# EAGLE design RoverPower (EAGLE 6.4)
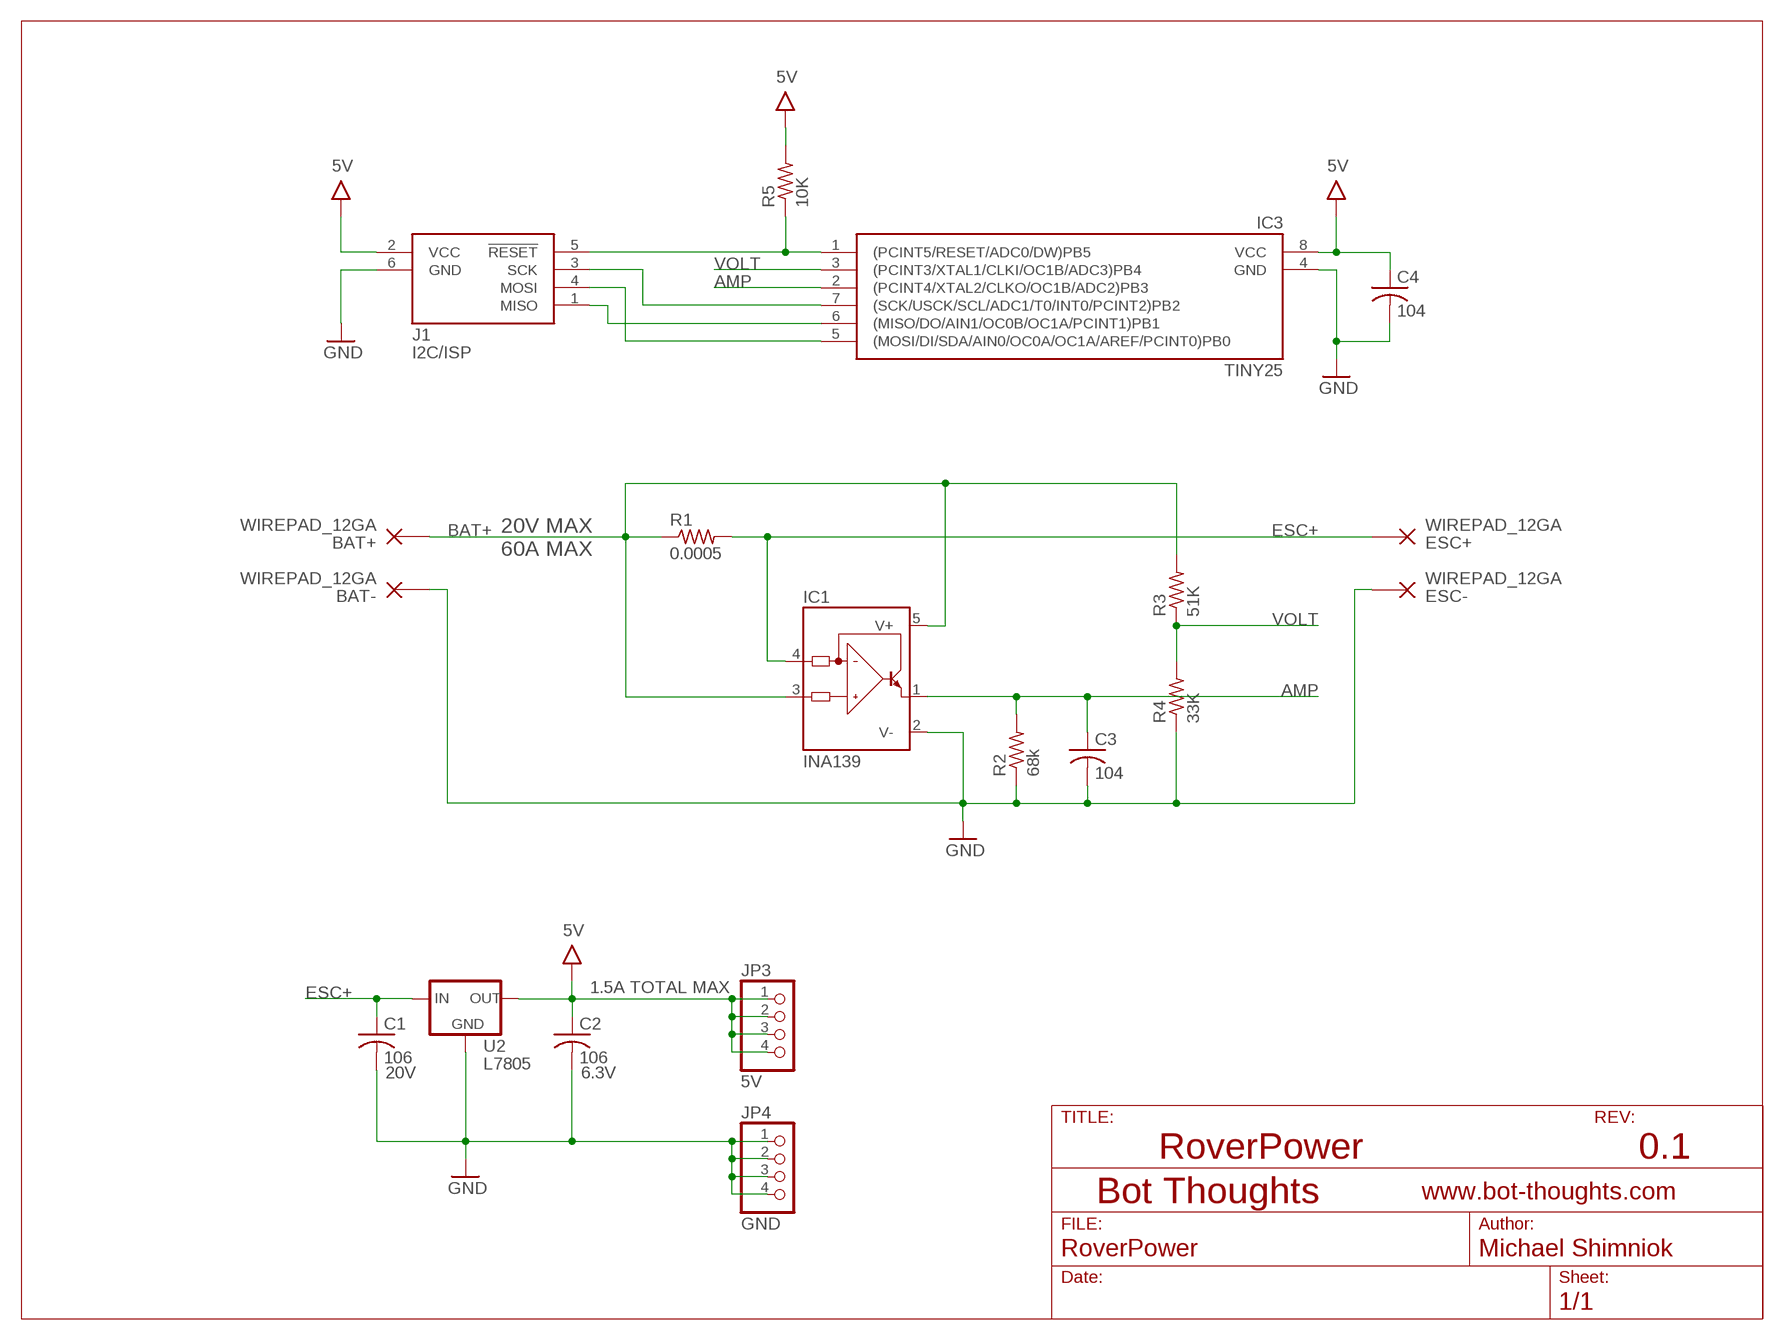
[diagram p0: schematic, sheet 1]

## Parts
BAT+  WIREPAD_12GA  [PAD_12GA]
BAT-  WIREPAD_12GA  [PAD_12GA]
C1  106  C-USC1206  [C1206]
C2  106  C-USC1206  [C1206]
C3  104  C-USC0603  [C0603]
C4  104  C-USC0603  [C0603]
ESC+  WIREPAD_12GA  [PAD_12GA]
ESC-  WIREPAD_12GA  [PAD_12GA]
IC1  INA139  INA168  [SOT23-5]
IC3  TINY25  TINY25/45/85-20SU  [SOIC8]
J1  I2C/ISP  AVRISP6  [CON6P2R]
JP3  5V  PINHD-1X04_2.54-S  [1X04-S]
JP4  GND  PINHD-1X04_2.54-S  [1X04-S]
R1  0.0005  R-US__2512  [R2512]
R2  68k  R-US_R0603  [R0603]
R3  51K  R-US_R0603  [R0603]
R4  33K  R-US_R0603  [R0603]
R5  10K  R-US_R0603  [R0603]
U2  L7805  L78XXD2TT  [D2PAK]

## Nets
5V: C2.1 C4.1 IC3.8(VCC) J1.2(VCC) JP3.1 JP3.2 JP3.3 JP3.4 R5.2 U2.3(OUT)
!RESET: IC3.1((PCINT5/RESET/ADC0/DW)PB5) J1.5(!RESET) R5.1
AMP: C3.1 IC1.1(OUT) IC3.2((PCINT4/XTAL2/CLKO/OC1B/ADC2)PB3) R2.2
BAT+: BAT+.P$1(P) IC1.3(IN+) IC1.5(V+) R1.P$1 R3.2
ESC+: C1.1 ESC+.P$1(P) IC1.4(IN-) R1.P$2 U2.1(IN)
GND: BAT-.P$1(P) C1.2 C2.2 C3.2 C4.2 ESC-.P$1(P) IC1.2(V-) IC3.4(GND) J1.6(GND) JP4.1 JP4.2 JP4.3 JP4.4 R2.1 R4.1 U2.2(GND)
MISO: IC3.6((MISO/DO/AIN1/OC0B/OC1A/PCINT1)PB1) J1.1(MISO)
SCL: IC3.7((SCK/USCK/SCL/ADC1/T0/INT0/PCINT2)PB2) J1.3(SCK)
SDA: IC3.5((MOSI/DI/SDA/AIN0/OC0A/OC1A/AREF/PCINT0)PB0) J1.4(MOSI)
VOLT: IC3.3((PCINT3/XTAL1/CLKI/OC1B/ADC3)PB4) R3.1 R4.2

## Notes on the sheet
- 20V MAX
- 60A MAX
- 1.5A TOTAL MAX
- RoverPower | 0.1

## Library data of the parts
BAT+ BAT- ESC+ ESC- = bt_electromech:WIREPAD: PIN PAD (PINPAD) Generic pin pad connector
C1 = rcl:C-US: CAPACITOR, American symbol; VOLTAGE: 20V
C2 = rcl:C-US: CAPACITOR, American symbol; VOLTAGE: 6.3V
C3 = resistor:C-US: CAPACITOR, American symbol
C4 = rcl:C-US: CAPACITOR, American symbol
IC1 = burr-brown:INA168: High-Side Measurement Current Shunt Monitor; MF: TEXAS INSTRUMENTS; MPN: INA168NA/250; OC_FARNELL: 4375737; OC_NEWARK: 35C1744
IC3 = bt_avr:TINY25/45/85: Atmel AVR ATiny25,45,85 8-bit Microcontroller
J1 = bt_avr:AVRISP6: 6-pin dual-row connector for Atmel AVRISP programmer interface
JP3 JP4 = pinhead-2:PINHD-1X04: PIN HEADER
R1 = bt:R-US_: RESISTOR, American symbol
R2 = rcl:R-US_: RESISTOR, American symbol
R3-R5 = resistor:R-US_: RESISTOR, American symbol
U2 = v-reg-3:L78XX: VOLTAGE REGULATOR

## Board
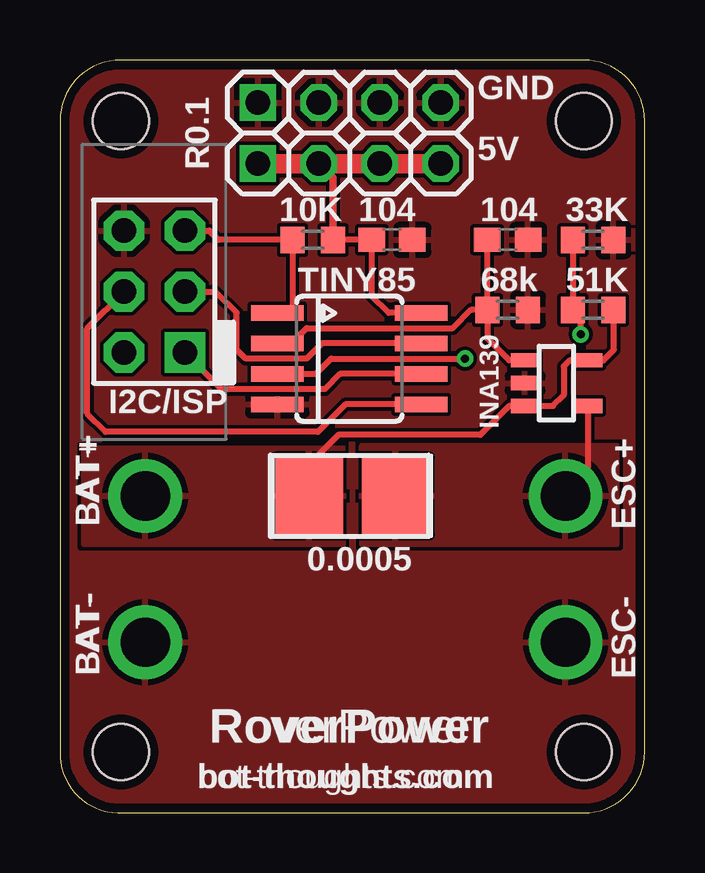
[diagram p1: board, top side]
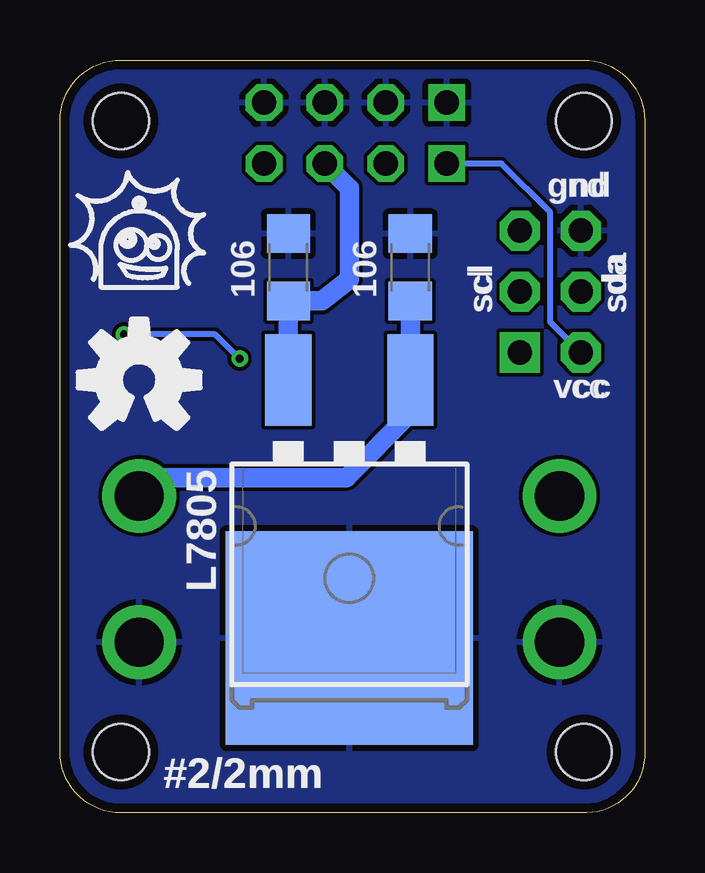
[diagram p2: board, bottom side, seen from below]

Size 24.38 x 31.37 mm. Coordinates in mm from the lower left corner, seen from the top.
Outline: 0,28.83 0,2.54 arc90 2.41,0 21.84,0 arc90 24.38,2.54 24.38,28.83 arc90 21.84,31.37 2.54,31.37 arc90 0,28.83
Copper layers (1*16): Top 0.0356mm / dielectric 1.5011mm / Bottom 0.0356mm
Design rules "LaenPCBOrder": minimum track width 6mil, minimum drill 13mil, track to track 6mil, track to pad 6mil, pad to pad 6mil, via to via 6mil, smd to smd 6mil, copper to edge 15mil, drill to drill 6mil, minimum pad ring 7mil, minimum via ring 7mil, stop-mask expansion 4mil, vias tented up to drill 20mil, thermal gap 10mil
Holes 2.34 mm at 2.54,28.83 21.84,28.83 2.54,2.54 21.84,2.54

### Footprints (pad centres in the part's own frame; a part is rotated, then mirrored left to right if it is on the bottom)
PAD_12GA = drill 2.056: P$1 0,0
C1206 = smd 1.6 x 1.8: 1 -1.4,0; 2 1.4,0
C0603 = smd 1.1 x 1: 1 -0.85,0; 2 0.85,0
SOT23-5 = smd 0.6 x 1.2: 1 -0.95,-1.306; 2 0,-1.306; 3 0.95,-1.306; 4 0.95,1.306; 5 -0.95,1.306
SOIC8 = smd 0.66 x 2.2: 1 -1.905,-3; 2 -0.635,-3; 3 0.635,-3; 4 1.905,-3; 5 1.905,3; 6 0.635,3; 7 -0.635,3; 8 -1.905,3
CON6P2R = drill 1.016 pad 1.676 square: 1 -2.54,-1.27 | drill 1.016 pad 1.676 octagon: 2 -2.54,1.27; 3 0,-1.27; 4 0,1.27; 5 2.54,-1.27; 6 2.54,1.27
1X04-S = drill 1.016 square: 1 -3.81,0 | drill 1.016 octagon: 2 -1.27,0; 3 1.27,0; 4 3.81,0
R2512 = smd 2.8 x 3.2: P$1 -1.8,0; P$2 1.8,0
R0603 = smd 1 x 1.1: 1 -0.85,0; 2 0.85,0
D2PAK = smd 1.93 x 3.81: 1 -2.55,-8.25; 3 2.55,-8.25 | smd 10.3 x 8.9: 2 0,2.5

### Placement (x,y rotation side)
BAT+  3.56,13.21 90 top
BAT-  3.56,7.11 90 top
C1  9.78,22.73 90 bottom
C2  14.86,22.73 90 bottom
C3  18.67,23.88 0 top
C4  13.84,23.88 0 top
ESC+  21.08,13.21 270 top
ESC-  21.08,7.11 270 top
IC1  20.7,17.91 270 top
IC3  TINY85  [SOIC8]  12.06,18.92 270 top
J1  3.94,21.72 90 top
JP3  12.06,27.05 0 top
JP4  12.06,29.59 0 top
R1  12.19,13.21 0 top
R2  18.67,20.95 180 top
R3  22.23,20.95 0 top
R4  22.23,23.88 180 top
R5  10.54,23.88 0 top
U2  12.32,9.78 180 bottom

### Tracks (layer width: path | path; a pad name or v marks a point on that pad's centre or on a via)
5V
  Top 0.254: R5.2 C4.1 12.99,21.55 13.72,20.83 IC3.8
  Top 0.305: R5.2 11.39,26.45 JP3.2
  Top 0.813: JP3.1 JP3.2 JP3.3 JP3.4
  Bottom 0.254: J1.2 3.94,20.45 3.94,25.02 5.97,27.05 JP3.1
  Bottom 0.813: U2.3 14.87,19.55 C2.1 13.46,21.33 12.32,22.23 12.32,26.04 JP3.3
!RESET
  Top 0.254: IC3.1 9.69,20.85 R5.1 6.6,23.88 6.22,24.26 J1.5
AMP
  Top 0.254: IC3.2 9.66,19.57 10.29,20.19 16.38,20.19 17.14,20.95 R2.2 | R2.2 C3.1 | IC1.1 18.73,18.86 17.82,19.77 R2.2
BAT+
  Top 0.254: R1.P$1 10.27,14.41 11.61,15.75 17.53,15.75 18.73,16.96 IC1.3 20.56,16.96 21,17.4 21,18.6 21.26,18.86 IC1.5 22.66,18.86 23.1,19.3 23.1,20.93 R3.2
  pour Top: 1,15.2 11.8,15.2 11.8,11.2 1,11.2
ESC+
  Top 0.254: IC1.4 22.01,14.39 ESC+.P$1
  Bottom 0.813: C1.1 9.77,19.8 U2.1 9.77,16.65 12.45,13.97 20.32,13.97 ESC+.P$1
  pour Top: 12.6,15.3 23.2,15.3 23.2,11.2 12.6,11.2
GND
  pour Top (rank 3): 24.38,28.83 24.38,2.54 arc-90 21.84,0 2.54,0 arc-90 0,2.54 0,28.83 arc-90 2.54,31.37 21.84,31.37 arc-90
  pour Bottom (rank 3): 24.38,28.83 24.38,2.54 arc-90 21.84,0 2.54,0 arc-90 0,2.54 0,28.83 arc-90 2.54,31.37 21.84,31.37 arc-90
MISO
  Top 0.254: IC3.6 11.68,18.29 11.05,17.65 6.73,17.65 J1.1
SCL
  Top 0.254: IC3.7 10.92,19.56 10.29,18.92 7.75,18.92 7.37,19.3 7.37,20.83 6.48,21.72 J1.3
SDA
  Top 0.254: IC3.5 11.9,17.02 10.76,15.88 1.91,15.88 1.14,16.64 1.14,20.19 J1.4
VOLT  (via drill 0.33)
  Top 0.254: R4.2 R3.1 21.72,20.61 v21.72,19.94 | IC3.3 10.68,18.3 11.3,18.92 v16.89,18.92
  Bottom 0.254: v16.89,18.92 17.91,19.94 v21.72,19.94

### Text on the board
bPlace: gnd | sda | scl | vcc
tNames: R0.1 | RoverPower | bot-thoughts.com
bNames: #2/2mm
tsilk: GND | R0.1 | 5V | 10K | 104 | 104 | 33K | TINY85 | 68k | 51K | I2C/ISP | INA139 | BAT+ | ESC+ | 0.0005 | BAT- | ESC- | RoverPower | bot-thoughts.com
bsilk: gnd | sda | scl | 106 | 106 | vcc | L7805 | #2/2mm